# EAGLE schematic untitled (EAGLE 5.12)
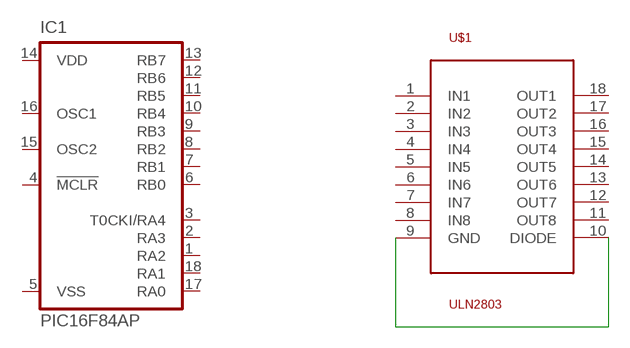
[diagram p0: schematic, sheet 1]

## Parts
IC1  PIC16F84AP  [DIL18]
U$1  ULN2803  [DIL18]

## Nets
GND: U$1.9(GND) U$1.10(DIODE)
Unconnected: IC1.1(RA2) IC1.2(RA3) IC1.3(T0CKI/RA4) IC1.4(!MCLR) IC1.6(RB0) IC1.7(RB1) IC1.8(RB2) IC1.9(RB3) IC1.10(RB4) IC1.11(RB5) IC1.12(RB6) IC1.13(RB7) IC1.15(OSC2) IC1.16(OSC1) IC1.17(RA0) IC1.18(RA1) U$1.1(IN1) U$1.2(IN2) U$1.3(IN3) U$1.4(IN4) U$1.5(IN5) U$1.6(IN6) U$1.7(IN7) U$1.8(IN8) U$1.11(OUT8) U$1.12(OUT7) U$1.13(OUT6) U$1.14(OUT5) U$1.15(OUT4) U$1.16(OUT3) U$1.17(OUT2) U$1.18(OUT1)

## Power pins joined to a net without a drawn wire
VDD: IC1.14(VDD)
VSS: IC1.5(VSS)

## Library data of the parts
IC1 = microchip:PIC16F8*: MICROCONTROLLER 8-Bit PIC16F8X Family - CMOS Flash/EEPROM Pin Compatible : PIC16F83, PIC16CR83, PIC16F84A, PIC16CR84 see also PIC16C* <DEVICE:PIC16C*>; MF: MICROCHIP; MPN: PIC16F84A-04I/P; OC_FARNELL: 9760865; OC_NEWARK: 69K7635
U$1 = uln2803:ULN2803